# EAGLE schematic ms2 (EAGLE 6.5.0)

## Sheet 1 of 4: Power
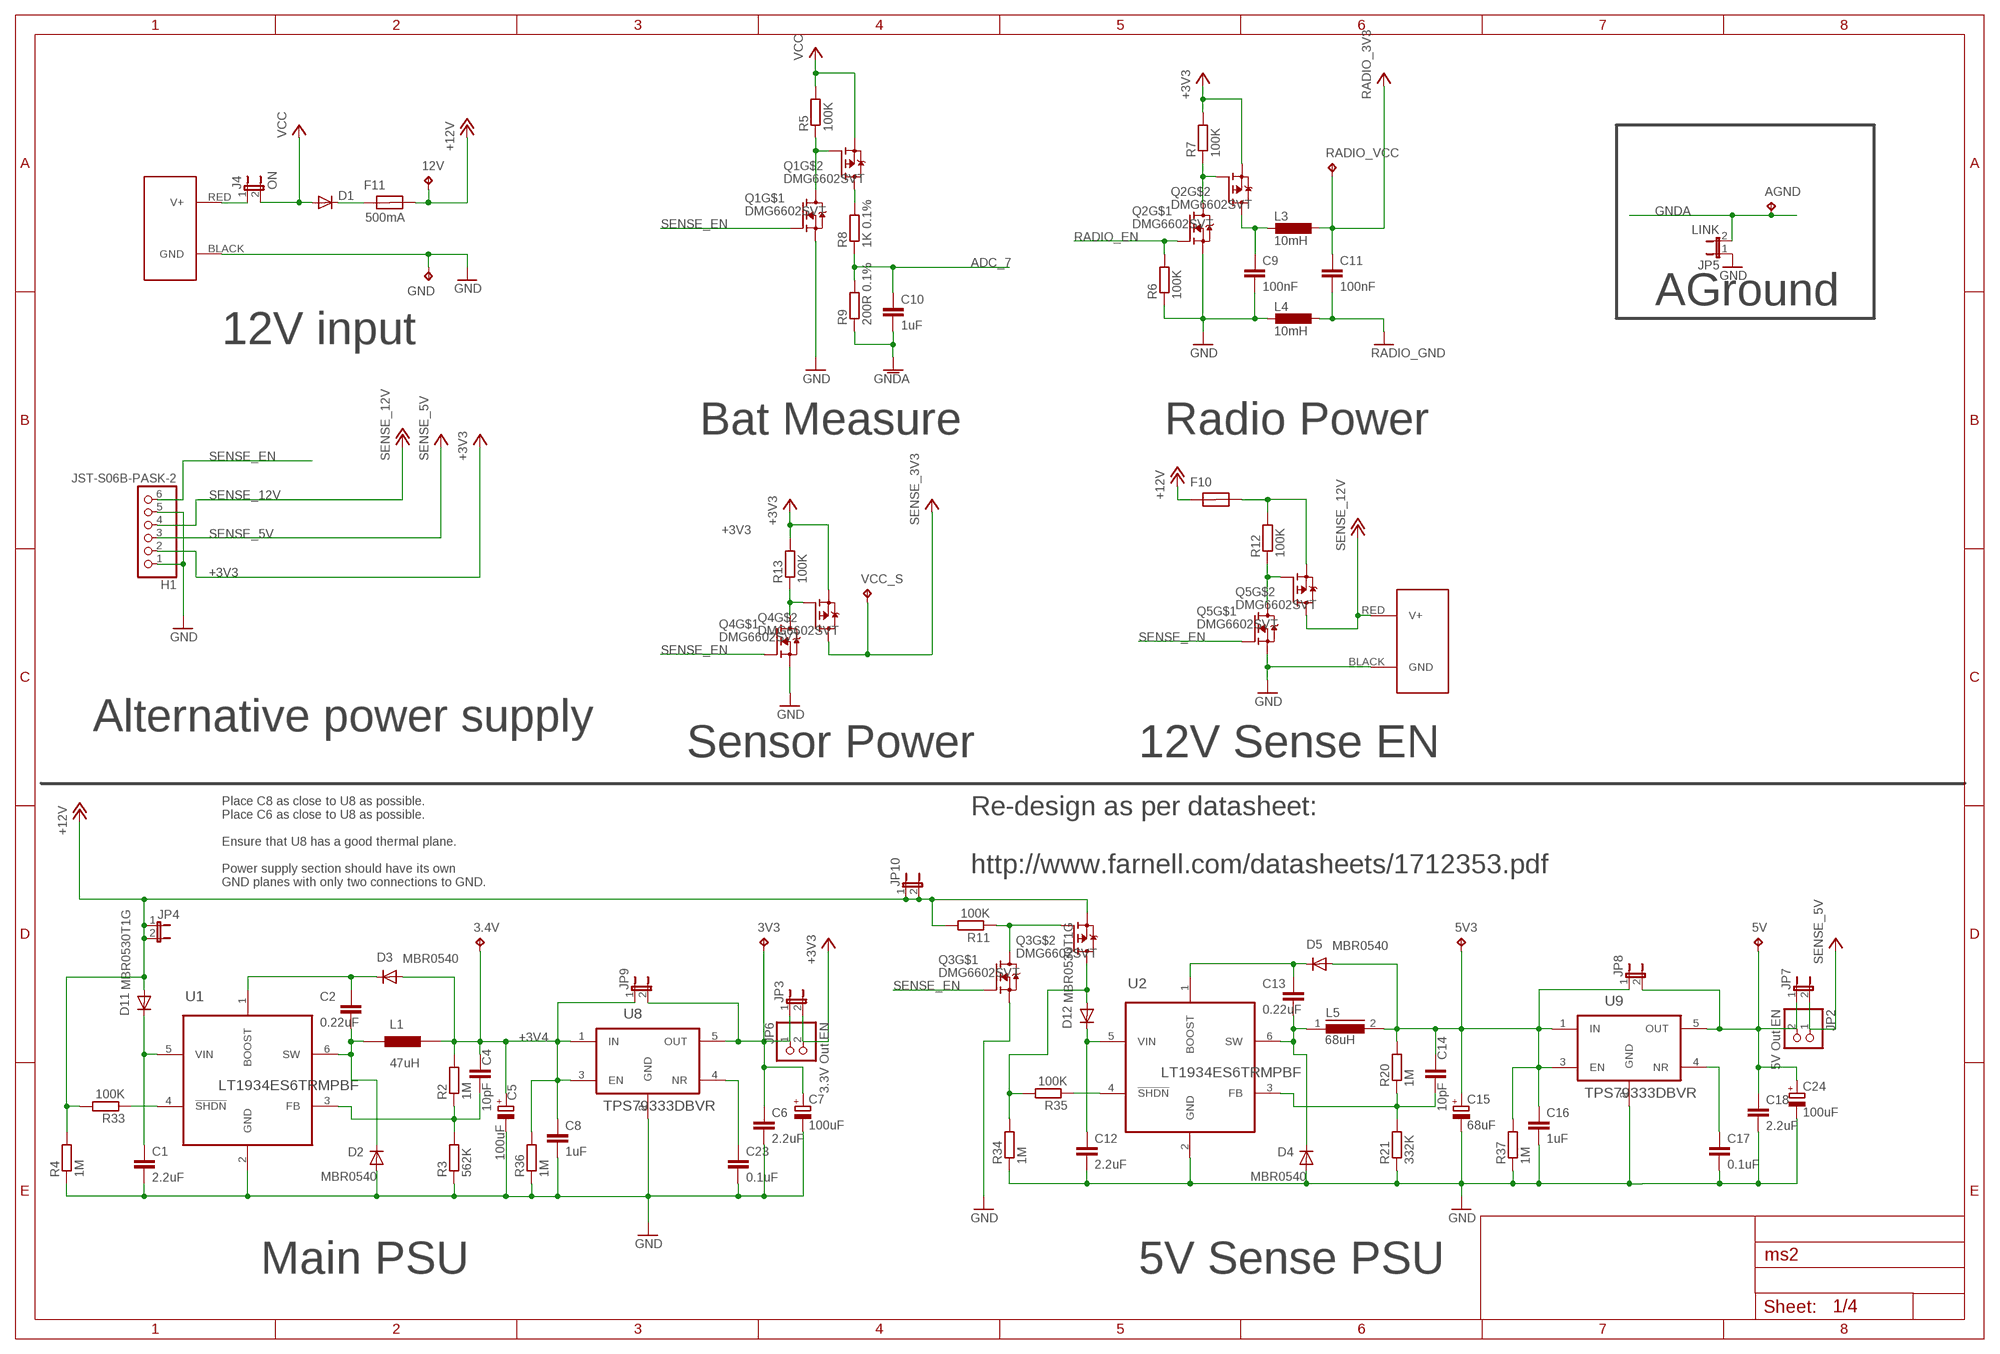
[diagram p0: schematic, sheet 1]

### Parts
3.4V  TPB2,54  [B2,54]
3V3  TPB2,54  [B2,54]
5V  5V B  TPB2,54  [B2,54]
5V3  5V B  TPB2,54  [B2,54]
12V  TPB2,54  [B2,54]
12V_OUT  POWERPOLE_POWER45A  [POWERPOLE_PAIR_45A]
AGND  TPB2,54  [B2,54]
C1  2.2uF  C-EUC0805  [C0805]
C2  0.22uF  C-EUC0805  [C0805]
C4  10pF  C-EUC0805  [C0805]
C5  100uF  CPOL-EUE  [PANASONIC_E]
C6  2.2uF  C-EUC0805  [C0805]
C7  100uF  CPOL-EUE  [PANASONIC_E]
C8  1uF  C-EUC0805  [C0805]
C9  100nF  C-EUC0805  [C0805]
C10  1uF  C-EUC0805  [C0805]
C11  100nF  C-EUC0805  [C0805]
C12  2.2uF  C-EUC0805  [C0805]
C13  0.22uF  C-EUC0805  [C0805]
C14  10pF  C-EUC0805  [C0805]
C15  68uF  CPOL-EUE  [PANASONIC_E]
C16  1uF  C-EUC0805  [C0805]
C17  0.1uF  C-EUC0805  [C0805]
C18  2.2uF  C-EUC0805  [C0805]
C23  0.1uF  C-EUC0805  [C0805]
C24  100uF  CPOL-EUE  [PANASONIC_E]
D1  DIODE-SMB  [SMB]
D2  MBR0540  MBR0520LT  [SOD123]
D3  MBR0540  MBR0520LT  [SOD123]
D4  MBR0540  MBR0520LT  [SOD123]
D5  MBR0540  MBR0520LT  [SOD123]
D11  MBR0530T1G  MBR0520LT  [SOD123]
D12  MBR0530T1G  MBR0520LT  [SOD123]
F10  MCF0805  [0805]
F11  MCF0805  [0805]
GND  5V B  TPB2,54  [B2,54]
H1  JST-S06B-PASK-2  [JST-PA-6-SE]
J1  POWERPOLE_POWER45A  [POWERPOLE_PAIR_45A]
J4  ON  2-PIN-MOLEX  [2-MOLEX]
JP2  5V Out EN  PINHD-1X2  [1X02]
JP3  JUMPER-2SMD-NO  [SJ_2S-NO]
JP4  JUMPER-2SMD-NO  [SJ_2S-NO]
JP5  LINK  JP1E  [JP1]
JP6  3.3V Out EN  PINHD-1X2  [1X02]
JP7  JUMPER-2SMD-NO  [SJ_2S-NO]
JP8  JUMPER-2SMD-NO  [SJ_2S-NO]
JP9  JUMPER-2SMD-NO  [SJ_2S-NO]
JP10  JUMPER-2SMD-NO  [SJ_2S-NO]
L1  47uH  SRU1048  [1048]
L3  10mH  L-EUL3230M  [L3230M]
L4  10mH  L-EUL3230M  [L3230M]
L5  68uH  DR127  [DR127]
Q1  DMG6602SVT  [TSOT26]
Q2  DMG6602SVT  [TSOT26]
Q3  DMG6602SVT  [TSOT26]
Q4  DMG6602SVT  [TSOT26]
Q5  DMG6602SVT  [TSOT26]
R2  1M  R-EU_R0805  [R0805]
R3  562K  R-EU_R0805  [R0805]
R4  1M  R-EU_R0805  [R0805]
R5  100K  R-EU_R0805  [R0805]
R6  100K  R-EU_R0805  [R0805]
R7  100K  R-EU_R0805  [R0805]
R8  1K 0.1%  R-EU_R0805  [R0805]
R9  200R 0.1%  R-EU_R0805  [R0805]
R11  100K  R-EU_R0805  [R0805]
R12  100K  R-EU_R0805  [R0805]
R13  100K  R-EU_R0805  [R0805]
R20  1M  R-EU_R0805  [R0805]
R21  332K  R-EU_R0805  [R0805]
R33  100K  R-EU_R0805  [R0805]
R34  1M  R-EU_R0805  [R0805]
R35  100K  R-EU_R0805  [R0805]
R36  1M  R-EU_R0805  [R0805]
R37  1M  R-EU_R0805  [R0805]
RADIO_VCC  TPB2,54  [B2,54]
U1  LT1934ES6TRMPBF  [SOT95P280X100-6N]
U2  LT1934ES6TRMPBF  [SOT95P280X100-6N]
U8  TPS79333DBVR  [SOT95P280X145-5N]
U9  TPS79333DBVR  [SOT95P280X145-5N]
VCC_S  TPB2,54  [B2,54]

### Nets
5V3: 5V3.TP C14.1 C15.+ C16.1 D5.A JP8.1 L5.2 R20.2 R37.2 U9.1(IN) U9.3(EN)
+3V3: H1.2 JP3.2 JP6.2 Q2.P$2(S) Q4.P$2(S) R7.2 R13.2 ; also sheet 2,3,4
+3V4: 3.4V.TP C4.1 C5.+ C8.1 D3.A JP9.1 L1.2 R2.2 R36.2 U8.1(IN) U8.3(EN)
+12V: 12V.TP D11.A F10.1 F11.2 JP4.1 JP4.2 JP10.1 JP10.2 Q3.P$2(S) R4.2 R11.2 R33.2
ADC_7: C10.1 R8.1 R9.2 ; also sheet 4
GND: 12V_OUT.BLACK(GND) C1.2 C5.- C6.2 C7.- C8.2 C9.2 C12.2 C15.- C16.2 C17.2 C18.2 C23.2 C24.- D2.A D4.A GND.TP H1.1 H1.5 J1.BLACK(GND) JP5.1 L4.2 Q1.P$5(S) Q2.P$5(S) Q3.P$5(S) Q4.P$5(S) Q5.P$5(S) R3.1 R4.1 R6.1 R21.1 R34.1 R36.1 R37.1 U1.2(GND) U2.2(GND) U8.2(GND) U9.2(GND) ; also sheet 2,3,4
GNDA: AGND.TP C10.2 JP5.2 R9.1 ; also sheet 4
N$1: J1.RED(V+) J4.1
N$4: C13.1 D5.C U2.1(BOOST)
N$5: D1.C F11.1
N$6: C23.1 U8.4(NR)
N$7: Q2.P$3(G) Q2.P$6(D) R7.1
N$12: Q1.P$3(G) Q1.P$6(D) R5.1
N$13: 5V.TP C18.1 C24.+ JP2.2 JP7.1 JP8.2 U9.5(OUT)
N$24: C9.1 L3.2 Q2.P$4(D)
N$25: Q3.P$3(G) Q3.P$6(D) R11.1
N$28: Q4.P$3(G) Q4.P$6(D) R13.1
N$29: C12.1 D12.C U2.5(VIN)
N$30: C13.2 D4.C L5.1 U2.6(SW)
N$31: C4.2 R2.1 R3.2 U1.3(FB)
N$32: 3V3.TP C6.1 C7.+ JP3.1 JP6.1 JP9.2 U8.5(OUT)
N$33: C14.2 R20.1 R21.2 U2.3(FB)
N$43: Q5.P$3(G) Q5.P$6(D) R12.1
N$44: F10.2 Q5.P$2(S) R12.2
N$45: C1.1 D11.C U1.5(VIN)
N$46: R33.1 U1.4(!SHDN)
N$48: R35.1 U2.4(!SHDN)
N$49: D12.A Q3.P$4(D) R34.2 R35.2
N$54: C17.1 U9.4(NR)
N$78: C2.2 D2.C L1.1 U1.6(SW)
N$117: C2.1 D3.C U1.1(BOOST)
RADIO_3V3: C11.1 L3.1 RADIO_VCC.TP ; also sheet 3,4
RADIO_EN: Q2.P$1(G) R6.2 ; also sheet 3,4
RADIO_GND: C11.2 L4.1 ; also sheet 4
SENSE_3V3: Q4.P$4(D) VCC_S.TP ; also sheet 2,3,4
SENSE_5V: H1.3 JP2.1 JP7.2 ; also sheet 3,4
SENSE_12V: 12V_OUT.RED(V+) H1.4 Q5.P$4(D) ; also sheet 3
SENSE_EN: H1.6 Q1.P$1(G) Q3.P$1(G) Q4.P$1(G) Q5.P$1(G) ; also sheet 2,3,4
VCC: D1.A J4.2 Q1.P$2(S) R5.2 ; also sheet 3
VCC_HP2_SW1: Q1.P$4(D) R8.2

### Notes on the sheet
- 500mA
- AGround
- 12V input
- Bat Measure | Radio Power
- Alternative power supply
- Sensor Power | 12V Sense EN
- Re-design as per datasheet: 
  
  http://www.farnell.com/datasheets/1712353.pdf
- Place C8 as close to U8 as possible.
  Place C6 as close to U8 as possible.
  
  Ensure that U8 has a good thermal plane.
  
  Power supply section should have its own 
  GND planes with only two connections to GND.
- Main PSU | 5V Sense PSU

## Sheet 2 of 4: ICs
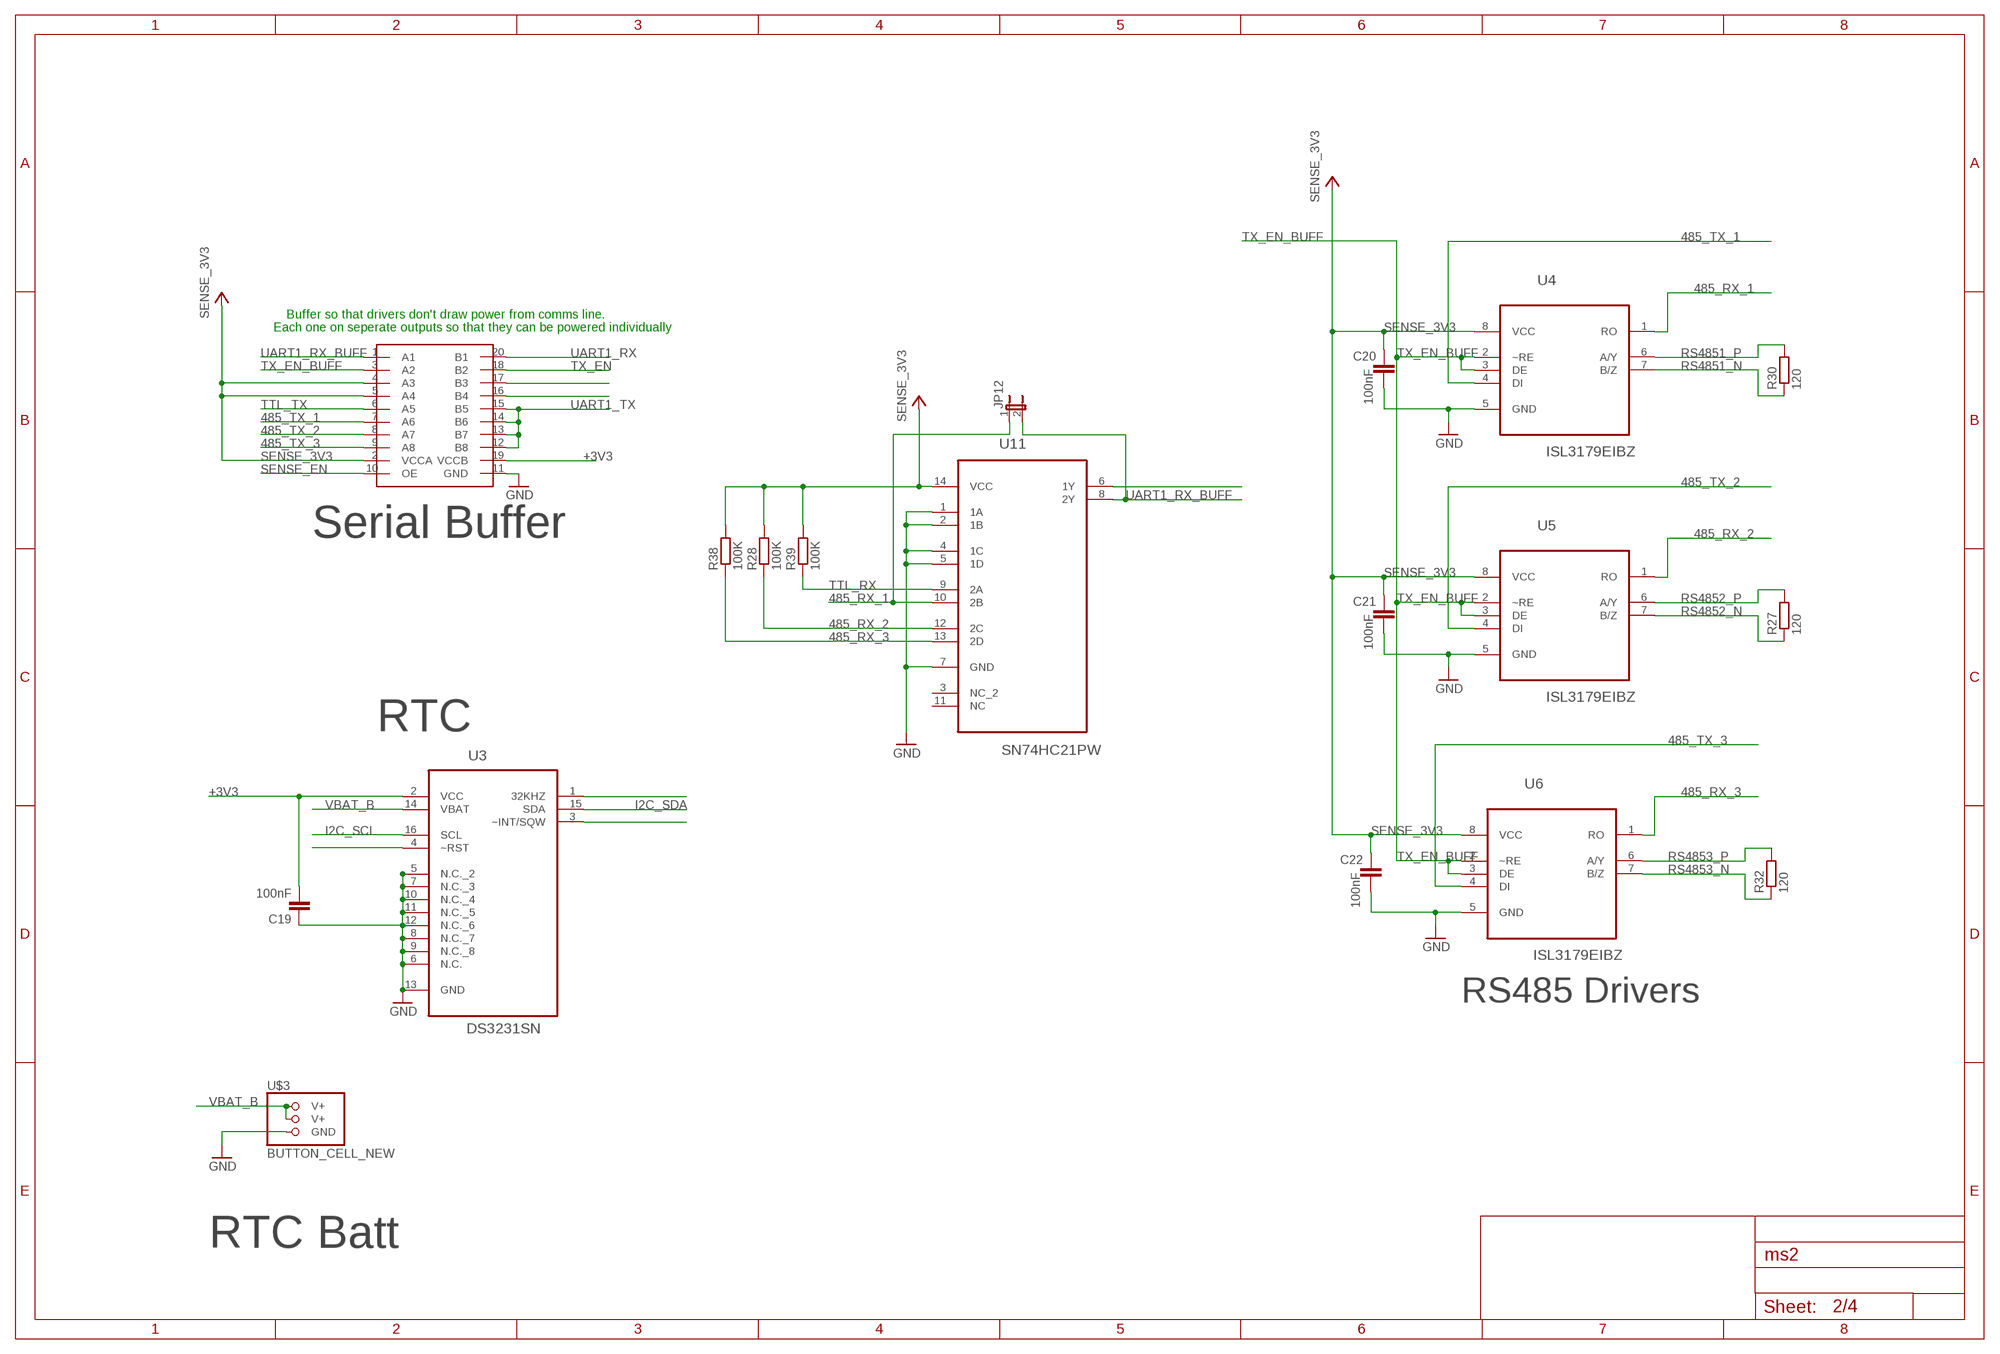
[diagram p1: schematic, sheet 2]

### Parts
C19  100nF  C-EUC0805  [C0805]
C20  100nF  C-EUC0805  [C0805]
C21  100nF  C-EUC0805  [C0805]
C22  100nF  C-EUC0805  [C0805]
JP12  JUMPER-2SMD-NO  [SJ_2S-NO]
R27  120  R-EU_R0805  [R0805]
R28  100K  R-EU_R0805  [R0805]
R30  120  R-EU_R0805  [R0805]
R32  120  R-EU_R0805  [R0805]
R38  100K  R-EU_R0805  [R0805]
R39  100K  R-EU_R0805  [R0805]
U3  DS3231SN  [SOIC127P1032X265-16N]
U4  ISL3179EIBZ  [SOIC127P600X175-8N]
U5  ISL3179EIBZ  [SOIC127P600X175-8N]
U6  ISL3179EIBZ  [SOIC127P600X175-8N]
U10  TXS0108E  [TSSOP20]
U11  SN74HC21PW  [SOP65P640X120-14N]
U$3  BUTTON_CELL_NEW  [CR2016]

### Nets
485_RX_1: JP12.1 U4.1(RO) U11.10(2B)
485_RX_2: R28.1 U5.1(RO) U11.12(2C)
485_RX_3: R38.1 U6.1(RO) U11.13(2D)
485_TX_1: U4.4(DI) U10.7(A6)
485_TX_2: U5.4(DI) U10.8(A7)
485_TX_3: U6.4(DI) U10.9(A8)
+3V3: C19.2 U3.2(VCC) U10.19(VCCB) ; also sheet 1,3,4
GND: C19.1 C20.2 C21.2 C22.2 U3.5(N.C._2) U3.6(N.C.) U3.7(N.C._3) U3.8(N.C._7) U3.9(N.C._8) U3.10(N.C._4) U3.11(N.C._5) U3.12(N.C._6) U3.13(GND) U4.5(GND) U5.5(GND) U6.5(GND) U10.11(GND) U11.1(1A) U11.2(1B) U11.4(1C) U11.5(1D) U11.7(GND) U$3.GND ; also sheet 1,3,4
I2C_SCL: U3.16(SCL) ; also sheet 4
I2C_SDA: U3.15(SDA) ; also sheet 4
N$3: U3.1(32KHZ)
N$8: U11.6(1Y)
N$14: U3.3(~INT/SQW)
N$52: U3.4(~RST)
N$57: U10.17(B3)
N$58: U10.16(B4)
RS4851_N [rs485]: R30.1 U4.7(B/Z) ; also sheet 4
RS4851_P [rs485]: R30.2 U4.6(A/Y) ; also sheet 4
RS4852_N [rs485]: R27.1 U5.7(B/Z) ; also sheet 4
RS4852_P [rs485]: R27.2 U5.6(A/Y) ; also sheet 4
RS4853_N [rs485]: R32.1 U6.7(B/Z) ; also sheet 4
RS4853_P [rs485]: R32.2 U6.6(A/Y) ; also sheet 4
SENSE_3V3: C20.1 C21.1 C22.1 R28.2 R38.2 R39.2 U4.8(VCC) U5.8(VCC) U6.8(VCC) U10.2(VCCA) U10.4(A3) U10.5(A4) U11.14(VCC) ; also sheet 1,3,4
SENSE_EN: U10.10(OE) ; also sheet 1,3,4
TTL_RX: R39.1 U11.9(2A) ; also sheet 4
TTL_TX: U10.6(A5) ; also sheet 4
TX_EN: U10.18(B2) ; also sheet 3,4
TX_EN_BUFF: U4.2(~RE) U4.3(DE) U5.2(~RE) U5.3(DE) U6.2(~RE) U6.3(DE) U10.3(A2)
UART1_RX: U10.20(B1) ; also sheet 4
UART1_RX_BUFF: JP12.2 U10.1(A1) U11.8(2Y)
UART1_TX: U10.12(B8) U10.13(B7) U10.14(B6) U10.15(B5) ; also sheet 4
VBAT_B: U3.14(VBAT) U$3.V+@1(V+) U$3.V+@2(V+)
Unconnected: U11.3(NC_2) U11.11(NC)

### Notes on the sheet
- Buffer so that drivers don't draw power from comms line.
- Each one on seperate outputs so that they can be powered individually
- Serial Buffer
- RTC
- RS485 Drivers
- RTC Batt

## Sheet 3 of 4: HMI
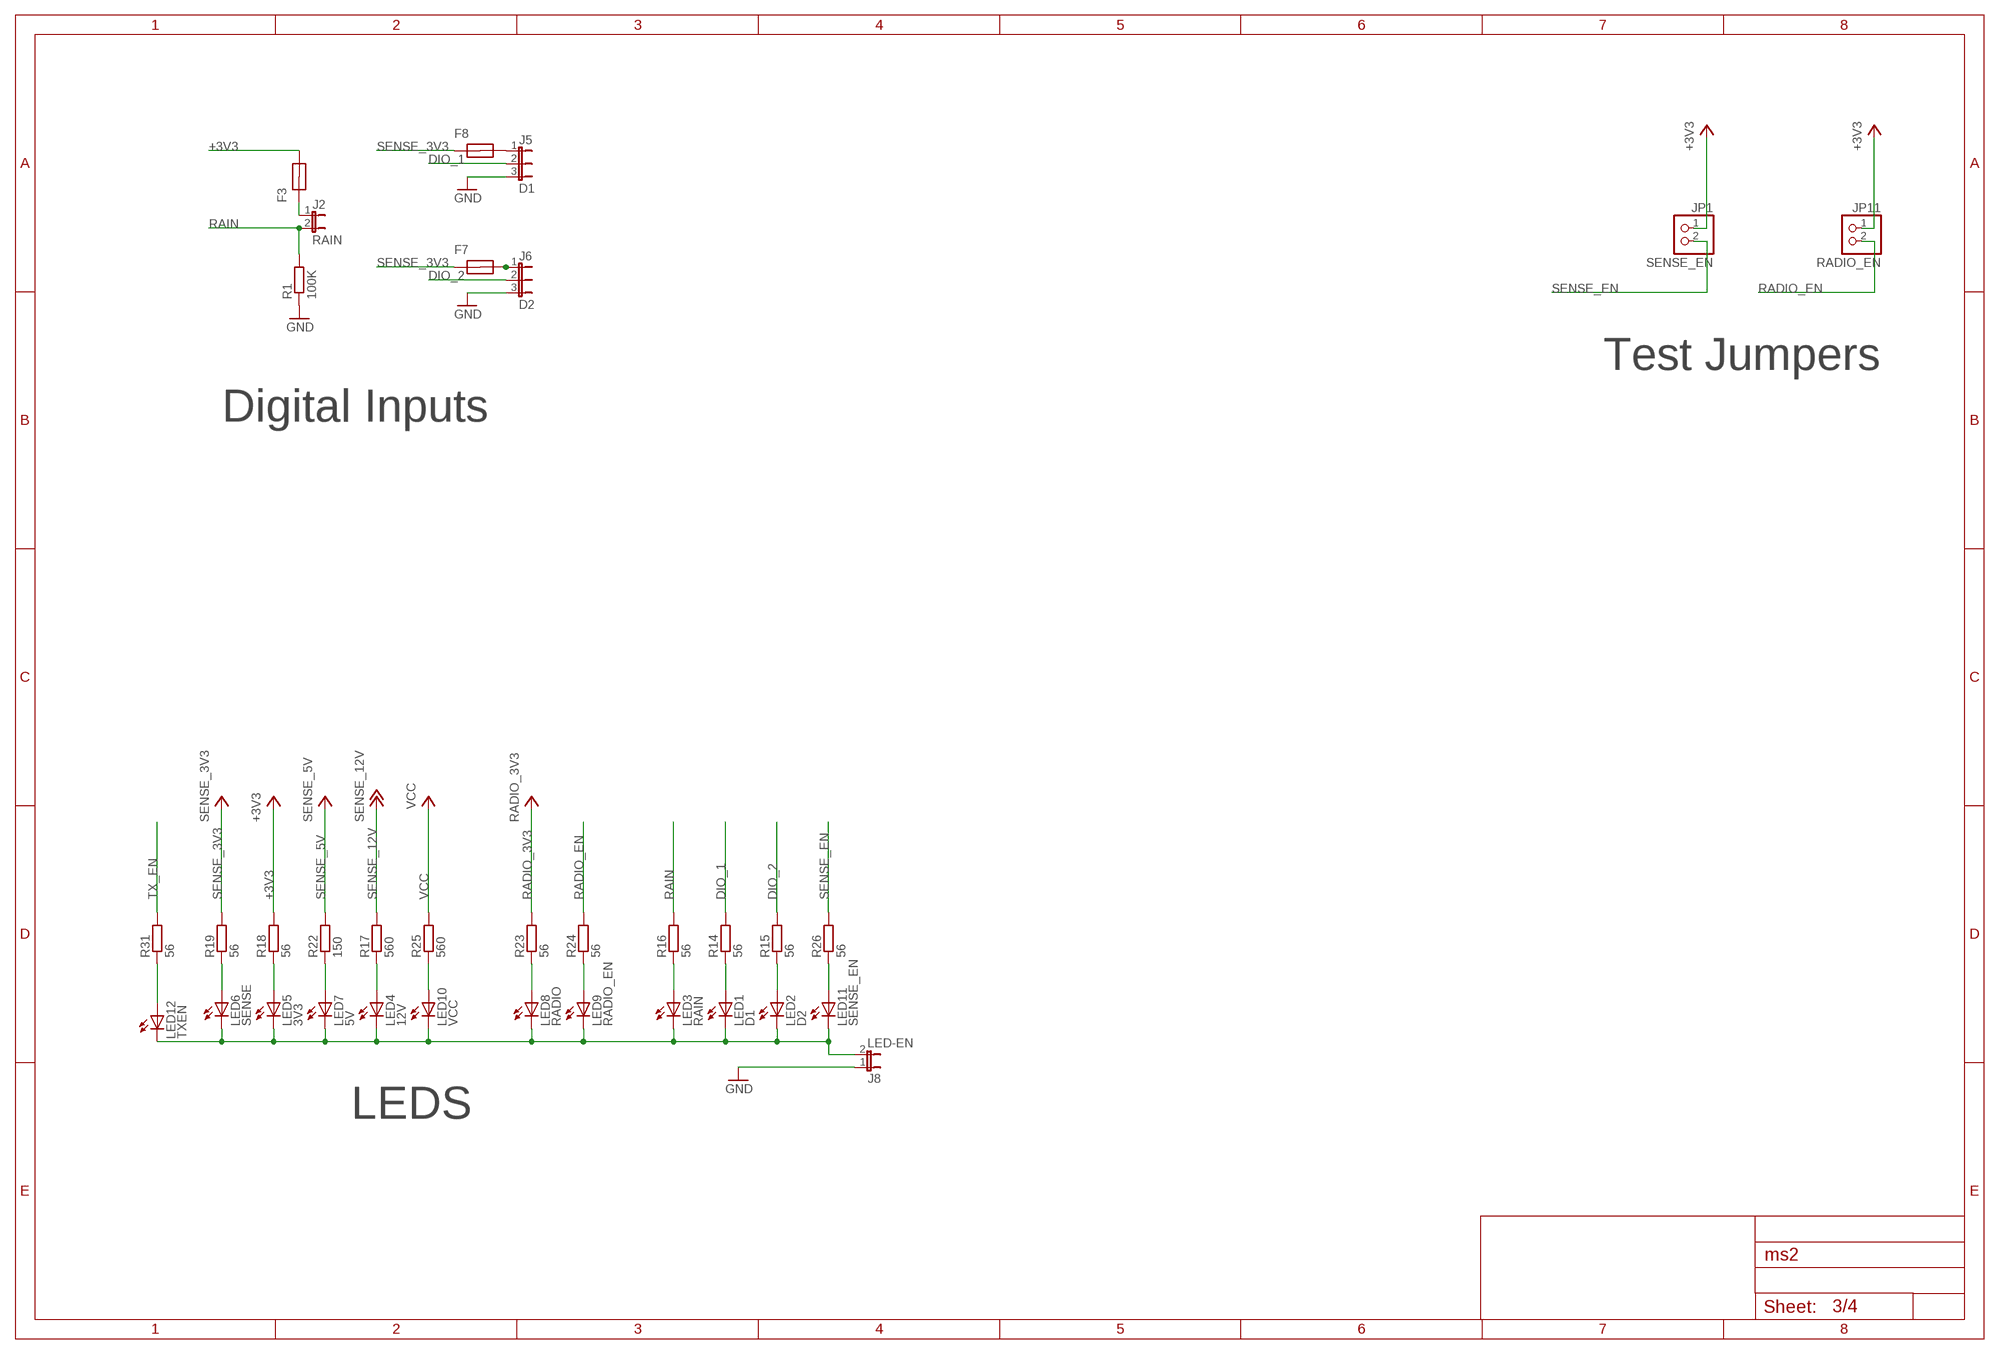
[diagram p2: schematic, sheet 3]

### Parts
F3  MCF0805  [0805]
F7  MCF0805  [0805]
F8  MCF0805  [0805]
J2  RAIN  2-PIN-MOLEX  [2-MOLEX]
J5  D1  3-PIN-MOLEX  [3-MOLEX]
J6  D2  3-PIN-MOLEX  [3-MOLEX]
J8  LED-EN  2-PIN-MOLEX  [2-MOLEX]
JP1  SENSE_EN  PINHD-1X2  [1X02]
JP11  RADIO_EN  PINHD-1X2  [1X02]
LED1  D1  LEDCHIP-LED0805  [CHIP-LED0805]
LED2  D2  LEDCHIP-LED0805  [CHIP-LED0805]
LED3  RAIN  LEDCHIP-LED0805  [CHIP-LED0805]
LED4  12V  LEDCHIP-LED0805  [CHIP-LED0805]
LED5  3V3  LEDCHIP-LED0805  [CHIP-LED0805]
LED6  SENSE  LEDCHIP-LED0805  [CHIP-LED0805]
LED7  5V  LEDCHIP-LED0805  [CHIP-LED0805]
LED8  RADIO  LEDCHIP-LED0805  [CHIP-LED0805]
LED9  RADIO_EN  LEDCHIP-LED0805  [CHIP-LED0805]
LED10  VCC  LEDCHIP-LED0805  [CHIP-LED0805]
LED11  SENSE_EN  LEDCHIP-LED0805  [CHIP-LED0805]
LED12  TXEN  LEDCHIP-LED0805  [CHIP-LED0805]
R1  100K  R-EU_R0805  [R0805]
R14  56  R-EU_R0805  [R0805]
R15  56  R-EU_R0805  [R0805]
R16  56  R-EU_R0805  [R0805]
R17  560  R-EU_R0805  [R0805]
R18  56  R-EU_R0805  [R0805]
R19  56  R-EU_R0805  [R0805]
R22  150  R-EU_R0805  [R0805]
R23  56  R-EU_R0805  [R0805]
R24  56  R-EU_R0805  [R0805]
R25  560  R-EU_R0805  [R0805]
R26  56  R-EU_R0805  [R0805]
R31  56  R-EU_R0805  [R0805]

### Nets
+3V3: F3.2 JP1.1 JP11.1 R18.2 ; also sheet 1,2,4
DIO_1: J5.2 R14.2 ; also sheet 4
DIO_2: J6.2 R15.2 ; also sheet 4
GND: J5.3 J6.3 J8.1 R1.1 ; also sheet 1,2,4
LGND: J8.2 LED1.C LED2.C LED3.C LED4.C LED5.C LED6.C LED7.C LED8.C LED9.C LED10.C LED11.C LED12.C
N$2: LED4.A R17.1
N$15: LED9.A R24.1
N$16: LED3.A R16.1
N$20: LED2.A R15.1
N$21: F7.2 J6.1
N$22: F8.2 J5.1
N$23: LED1.A R14.1
N$26: F3.1 J2.1
N$27: LED12.A R31.1
N$51: LED11.A R26.1
N$53: LED10.A R25.1
N$108: LED8.A R23.1
N$109: LED7.A R22.1
N$110: LED6.A R19.1
N$111: LED5.A R18.1
RADIO_3V3: R23.2 ; also sheet 1,4
RADIO_EN: JP11.2 R24.2 ; also sheet 1,4
RAIN: J2.2 R1.2 R16.2 ; also sheet 4
SENSE_3V3: F7.1 F8.1 R19.2 ; also sheet 1,2,4
SENSE_5V: R22.2 ; also sheet 1,4
SENSE_12V: R17.2 ; also sheet 1
SENSE_EN: JP1.2 R26.2 ; also sheet 1,2,4
TX_EN: R31.2 ; also sheet 2,4
VCC: R25.2 ; also sheet 1

### Notes on the sheet
- Test Jumpers
- Digital Inputs
- LEDS

## Sheet 4 of 4: Headers
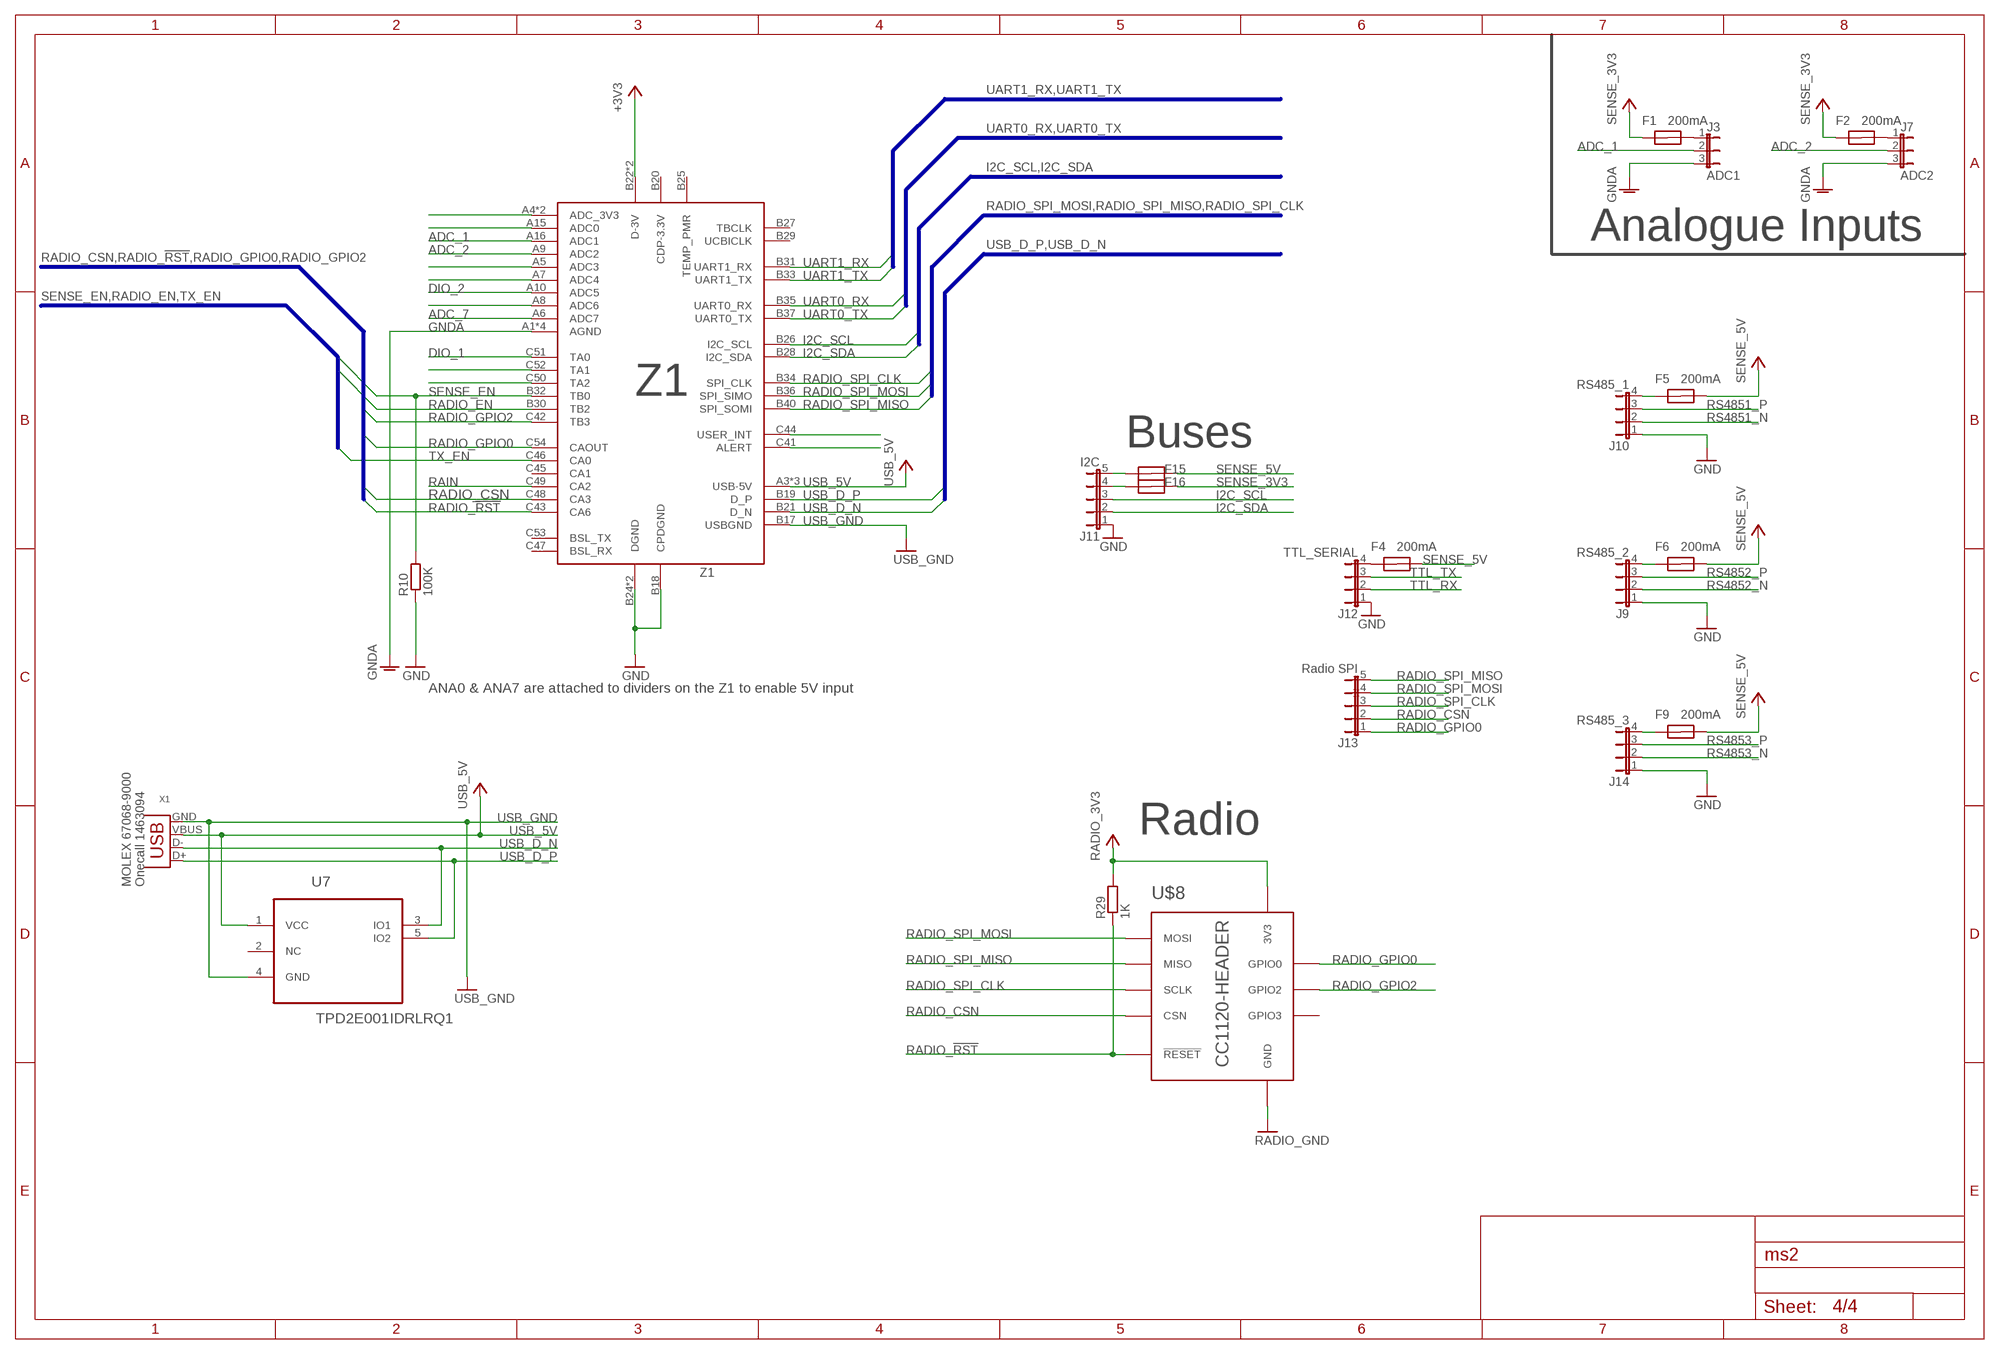
[diagram p3: schematic, sheet 4]

### Parts
F1  MCF0805  [0805]
F2  MCF0805  [0805]
F4  MCF0805  [0805]
F5  MCF0805  [0805]
F6  MCF0805  [0805]
F9  MCF0805  [0805]
F15  MCF0805  [0805]
F16  MCF0805  [0805]
J3  ADC1  3-PIN-MOLEX  [3-MOLEX]
J7  ADC2  3-PIN-MOLEX  [3-MOLEX]
J9  RS485_2  4-PIN-MOLEX  [4-MOLEX]
J10  RS485_1  4-PIN-MOLEX  [4-MOLEX]
J11  I2C  5-PIN-MOLEX  [5-MOLEX]
J12  TTL_SERIAL  4-PIN-MOLEX  [4-MOLEX]
J13  Radio SPI  5-PIN-MOLEX  [5-MOLEX]
J14  RS485_3  4-PIN-MOLEX  [4-MOLEX]
R10  100K  R-EU_R0805  [R0805]
R29  1K  R-EU_R0805  [R0805]
U7  TPD2E001IDRLRQ1  [SOT50P160X60-5N]
U$8  CC1120-HEADER-SMT  [CC1120-HEADERS-SMT]
X1  67068-9000  USB-B-H  [USB-B-H]
Z1  Z1  [Z1]

### Nets
+3V3: Z1.B22(D-3V) Z1.C40(D-3V) ; also sheet 1,2,3
ADC_1: J3.2 Z1.A16(ADC1)
ADC_2: J7.2 Z1.A9(ADC2)
ADC_7: Z1.A6(ADC7) ; also sheet 1
DIO_1: Z1.C51(TA0) ; also sheet 3
DIO_2: Z1.A10(ADC5) ; also sheet 3
GND: J9.1 J10.1 J11.1 J12.1 J14.1 R10.1 Z1.B18(CPDGND) Z1.B24(DGND) Z1.C39(DGND) ; also sheet 1,2,3
GNDA: J3.3 J7.3 Z1.A1(AGND) Z1.A2(AGND) Z1.A11(AGND) Z1.A12(AGND) ; also sheet 1
I2C_SCL: J11.3 Z1.B26(I2C_SCL) ; also sheet 2
I2C_SDA: J11.2 Z1.B28(I2C_SDA) ; also sheet 2
N$9: F5.1 J10.4
N$10: F6.1 J9.4
N$11: F4.1 J12.4
N$17: F9.1 J14.4
N$18: F1.2 J3.1
N$19: F2.2 J7.1
N$34: Z1.C52(TA1)
N$35: Z1.C50(TA2)
N$36: Z1.A8(ADC6)
N$37: Z1.A5(ADC3)
N$38: Z1.A7(ADC4)
N$39: Z1.A15(ADC0)
N$40: Z1.A4(ADC_3V3) Z1.A14(ADC_3V3)
N$41: Z1.C44(USER_INT)
N$42: Z1.C41(ALERT)
N$47: F16.1 J11.4
N$50: F15.1 J11.5
RADIO_3V3: R29.2 U$8.3V3-1(3V3) U$8.3V3-2(3V3) ; also sheet 1,3
RADIO_!RST: R29.1 U$8.RESET(!RESET) Z1.C43(CA6)
RADIO_CSN: J13.2 U$8.CSN Z1.C48(CA3)
RADIO_EN: Z1.B30(TB2) ; also sheet 1,3
RADIO_GND: U$8.GND U$8.GND1(GND) U$8.GND2(GND) ; also sheet 1
RADIO_GPIO0: J13.1 U$8.GPIO0 Z1.C54(CAOUT)
RADIO_GPIO2: U$8.GPIO2 Z1.C42(TB3)
RADIO_SPI_CLK: J13.3 U$8.SCLK Z1.B34(SPI_CLK)
RADIO_SPI_MISO: J13.5 U$8.MISO Z1.B40(SPI_SOMI)
RADIO_SPI_MOSI: J13.4 U$8.MOSI Z1.B36(SPI_SIMO)
RAIN: Z1.C49(CA2) ; also sheet 3
RS4851_N [rs485]: J10.2 ; also sheet 2
RS4851_P [rs485]: J10.3 ; also sheet 2
RS4852_N [rs485]: J9.2 ; also sheet 2
RS4852_P [rs485]: J9.3 ; also sheet 2
RS4853_N [rs485]: J14.2 ; also sheet 2
RS4853_P [rs485]: J14.3 ; also sheet 2
SENSE_3V3: F1.1 F2.1 F16.2 ; also sheet 1,2,3
SENSE_5V: F4.2 F5.2 F6.2 F9.2 F15.2 ; also sheet 1,3
SENSE_EN: R10.2 Z1.B32(TB0) ; also sheet 1,2,3
TTL_RX: J12.2 ; also sheet 2
TTL_TX: J12.3 ; also sheet 2
TX_EN: Z1.C46(CA0) ; also sheet 2,3
UART0_RX: Z1.B35(UART0_RX)
UART0_TX: Z1.B37(UART0_TX)
UART1_RX: Z1.B31(UART1_RX) ; also sheet 2
UART1_TX: Z1.B33(UART1_TX) ; also sheet 2
USB_5V: U7.1(VCC) X1.VBUS Z1.A3(USB-5V) Z1.A13(USB-5V) Z1.B23(USB-5V)
USB_D_N: U7.3(IO1) X1.D- Z1.B21(D_N)
USB_D_P: U7.5(IO2) X1.D+ Z1.B19(D_P)
USB_GND: U7.4(GND) X1.GND Z1.B17(USBGND)
Unconnected: U7.2(NC) U$8.GPIO3 Z1.B20(CDP-3.3V) Z1.B25(TEMP_PMR) Z1.B27(TBCLK) Z1.B29(UCBICLK) Z1.C45(CA1) Z1.C47(BSL_RX) Z1.C53(BSL_TX)

### Buses
UART1_RX,UART1_TX
UART0_RX,UART0_TX
I2C_SCL,I2C_SDA
RADIO_SPI_MOSI,RADIO_SPI_MISO,RADIO_SPI_CLK
RADIO_CSN,RADIO_!RST,RADIO_GPIO0,RADIO_GPIO2
SENSE_EN,RADIO_EN,TX_EN
USB_D_P,USB_D_N

### Notes on the sheet
- 200mA | 200mA
- Analogue Inputs
- 200mA
- Buses
- 200mA | 200mA
- ANA0 & ANA7 are attached to dividers on the Z1 to enable 5V input
- 200mA
- Radio
- MOLEX 67068-9000
  Onecall 1463094

## Library data of the parts
3.4V 3V3 5V 5V3 12V AGND GND RADIO_VCC VCC_S = testpad:TP: Test pad
12V_OUT J1 = powerpoles:POWERPOLE_POWER: Anderson Powerpole Power Connector using ameteur radio standard layout
C1 C2 C4 C6 C8-C14 C16-C19 C23 = resistor:C-EU: CAPACITOR, European symbol
C5 C7 C15 C24 = rcl:CPOL-EU: POLARIZED CAPACITOR, European symbol
C20-C22 = glacsweb:C-EU: CAPACITOR, European symbol
D1 = diode:DIODE-: DIODE
D2-D5 D11 D12 = diode:MBR0520LT: SCHOTTKY BARRIER RECTIFIER Source: http://onsemi.com .. MBR0520LT1-D.pdf
F1-F11 F15 F16 = farnell-parts:MCF0805
H1 = CC11x:JST-S06B-PASK-2: http://uk.farnell.com/jst-japan-solderless-terminals/s06b-pask-2/header-pa-6way-side-2mm/dp/1830751; MPN_ONECALL: 1830751
J2 J4 J8 = farnell-parts:2-PIN-MOLEX
J3 J5-J7 = farnell-parts:3-PIN-MOLEX
J9 J10 J12 J14 = farnell-parts:4-PIN-MOLEX
J11 J13 = farnell-parts:5-PIN-MOLEX
JP1 JP2 JP6 JP11 = pinhead:PINHD-1X2: PIN HEADER
JP3 JP4 JP7-JP10 JP12 = SparkFun-Passives:JUMPER-2: Jumper Basic 0.1" spaced jumper. Use with breakaway headers.
JP5 = jumper:JP1E: JUMPER
L1 = farnell-parts:SRU1048
L3 L4 = resistor:L-EU: INDUCTOR, European symbol
L5 = inductors:DR127: High Power Density, High Efficiency, Shielded Inductors Source: coiltronics_dr_series.pdf
LED1-LED12 = led:LED: LED OSRAM: - CHIPLED LG R971, LG N971, LY N971, LG Q971, LY Q971, LO R971, LY R971 LH N974, LH R974 LS Q976, LO Q976, LY Q976 LO Q996 - Hyper CHIPLED LW Q18S LB Q993, LB Q99A, LB R99A - SideLED LS A670, LO A670, LY A670, LG A670, LP A670 LB A673, LV A673, LT A673, LW A673 LH A674 LY A675 LS A676, LA A676, LO A676, LY A676, LW A676 LS A679, LY A679, LG A679 - Hyper Micro SIDELED® LS Y876, LA Y876, LO Y876, LY Y876 LT Y87S - SmartLED LW L88C, LW L88S LB L89C, LB L89S, LG L890 LS L89K, LO L89K, LY L89K LS L896, LA L896, LO L896, LY L896 - TOPLED LS T670, LO T670, LY T670, LG T670, LP T670 LSG T670, LSP T670, LSY T670, LOP T670, LYG T670 LG T671, LOG T671, LSG T671 LB T673, LV T673, LT T673, LW T673 LH T674 LS T676, LA T676, LO T676, LY T676, LB T676, LH T676, LSB T676, LW T676 LB T67C, LV T67C, LT T67C, LS T67K, LO T67K, LY T67K, LW E67C LS E67B, LA E67B, LO E67B, LY E67B, LB E67C, LV E67C, LT E67C LW T67C LS T679, LY T679, LG T679 LS T770, LO T770, LY T770, LG T770, LP T770 LB T773, LV T773, LT T773, LW T773 LH T774 LS E675, LA E675, LY E675, LS T675 LS T776, LA T776, LO T776, LY T776, LB T776 LHGB T686 LT T68C, LB T68C - Hyper Mini TOPLED® LB M676 - Mini TOPLED Santana® LG M470 LS M47K, LO M47K, LY M47K Source: http://www.osram.convergy.de LUXEON: - LUMILED® LXK2-PW12-R00, LXK2-PW12-S00, LXK2-PW14-U00, LXK2-PW14-V00 LXK2-PM12-R00, LXK2-PM12-S00, LXK2-PM14-U00 LXK2-PE12-Q00, LXK2-PE12-R00, LXK2-PE12-S00, LXK2-PE14-T00, LXK2-PE14-U00 LXK2-PB12-K00, LXK2-PB12-L00, LXK2-PB12-M00, LXK2-PB14-N00, LXK2-PB14-P00, LXK2-PB14-Q00 LXK2-PR12-L00, LXK2-PR12-M00, LXK2-PR14-Q00, LXK2-PR14-R00 LXK2-PD12-Q00, LXK2-PD12-R00, LXK2-PD12-S00 LXK2-PH12-R00, LXK2-PH12-S00 LXK2-PL12-P00, LXK2-PL12-Q00, LXK2-PL12-R00 Source: www.luxeon.com KINGBRIGHT: KA-3528ASYC Source: www.kingbright.com
Q1-Q5 = farnell-parts:DMG6602SVT
R1-R39 = resistor:R-EU_: RESISTOR, European symbol
U1 U2 = farnell-parts:LT1934ES6TRMPBF; DESCRIPTION: Micropower Step-Down Switching Regulators; MPN: LT1934ES6#TRMPBF; OC_FARNELL: 1663810; OC_NEWARK: 59M8316; PACKAGE: TSOT-23-6; SUPPLIER: Linear Technology
U3 = farnell-parts:DS3231SN: Extremely Accurate I2C-Integrated RTC/TCXO/Crystal; MPN: DS3231SN#; OC_FARNELL: 1593292; OC_NEWARK: 68K3406; PACKAGE: SOIC-16; SUPPLIER: Maxim
U4-U6 = glacsweb:ISL3179EIBZ: TRANCEIVER; MPN: ISL3179EIBZ; OC_FARNELL: 1439860; OC_NEWARK: 58M7513; PACKAGE: SOIC-8; SUPPLIER: Intersil
U7 = Texas Instruments_By_element14_Batch_1:TPD2E001IDRLRQ1: LOW-CAPACITANCE 2-CHANNEL ±15-kV ESD-PROTECTION ARRAY; MPN: TPD2E001IDRLRQ1; OC_FARNELL: -; OC_NEWARK: 55R7553; PACKAGE: SOT-23-5; SUPPLIER: Texas Instruments
U8 U9 = CC11x:TPS79333DBVR: LOW-DROPOUT LINEAR REGULATORS; MPN: TPS79333DBVR; OC_FARNELL: 1470478; OC_NEWARK: 77C1365; PACKAGE: SOT-23-5; SUPPLIER: Texas Instruments
U10 = basestation:TXS0108E: Texas Instruments TXS0108E 8-BIT BIDIRECTIONAL VOLTAGE-LEVEL TRANSLATOR FOR OPEN-DRAIN AND PUSH-PULL APPLICATIONS
U11 = CC11x:SN74HC21PW: Triple 3 Input positive NAND gate; MPN: SN74HC21PW; OC_FARNELL: 1741215; OC_NEWARK: 34R8760; PACKAGE: TSSOP-14; SUPPLIER: Texas Instruments
U$3 = gumsense:BUTTON_CELL_NEW
U$8 = CC11x:CC1120-HEADER; MANUFACTURER: HARWIN; MPN: M50-3601042; OC_FARNEL: CN14037; QTY: 2
X1 = con-usb-3:USB: USB Connectors
Z1 = z1:Z1

## Net classes
1 usb: width 0.305 mm, drill 0.356 mm, clearance 0.152 mm
2 rs485: width 0.305 mm, drill 0.356 mm, clearance 0.305 mm